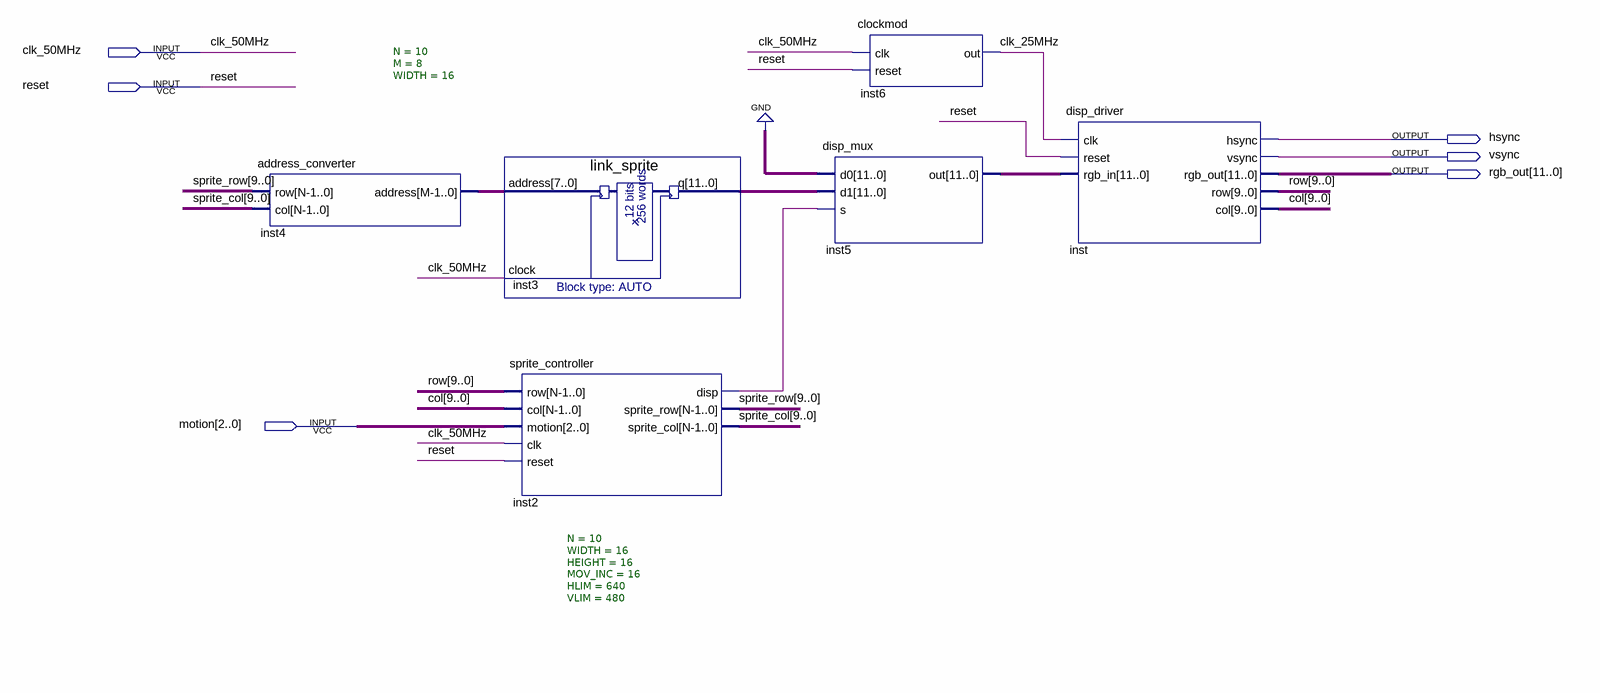
[diagram p0: schematic sheet]
// Quartus schematic sprite_block.bdf as structural Verilog: 6 symbols, 6 pins
module sprite_block (
  input  clk_50MHz,
  input  reset,
  input  [2:0] motion,
  output hsync,
  output vsync,
  output [11:0] rgb_out
);

  wire clk_25MHz, inst2_disp;
  wire [7:0] inst4_address;
  wire [9:0] col, row, sprite_col, sprite_row;
  wire [11:0] inst3_q, inst5_out;

  address_converter #(.N(10), .M(8), .WIDTH(16)) inst4 (.row(sprite_row), .col(sprite_col), .address(inst4_address));
  link_sprite inst3 (.address(inst4_address), .clock(clk_50MHz), .q(inst3_q));
  sprite_controller #(.N(10), .WIDTH(16), .HEIGHT(16), .MOV_INC(16), .HLIM(640), .VLIM(480)) inst2 (
    .row(row), .col(col), .motion(motion), .clk(clk_50MHz), .reset(reset), .disp(inst2_disp),
    .sprite_row(sprite_row), .sprite_col(sprite_col));
  disp_mux inst5 (.d0({12{1'b0}}), .d1(inst3_q), .s(inst2_disp), .out(inst5_out));
  clockmod inst6 (.clk(clk_50MHz), .reset(reset), .out(clk_25MHz));
  disp_driver inst (
    .clk(clk_25MHz), .reset(reset), .rgb_in(inst5_out), .hsync(hsync), .vsync(vsync), .rgb_out(rgb_out),
    .row(row), .col(col));
endmodule
